# EAGLE schematic PhotoBooth_04 (EAGLE 6.3)
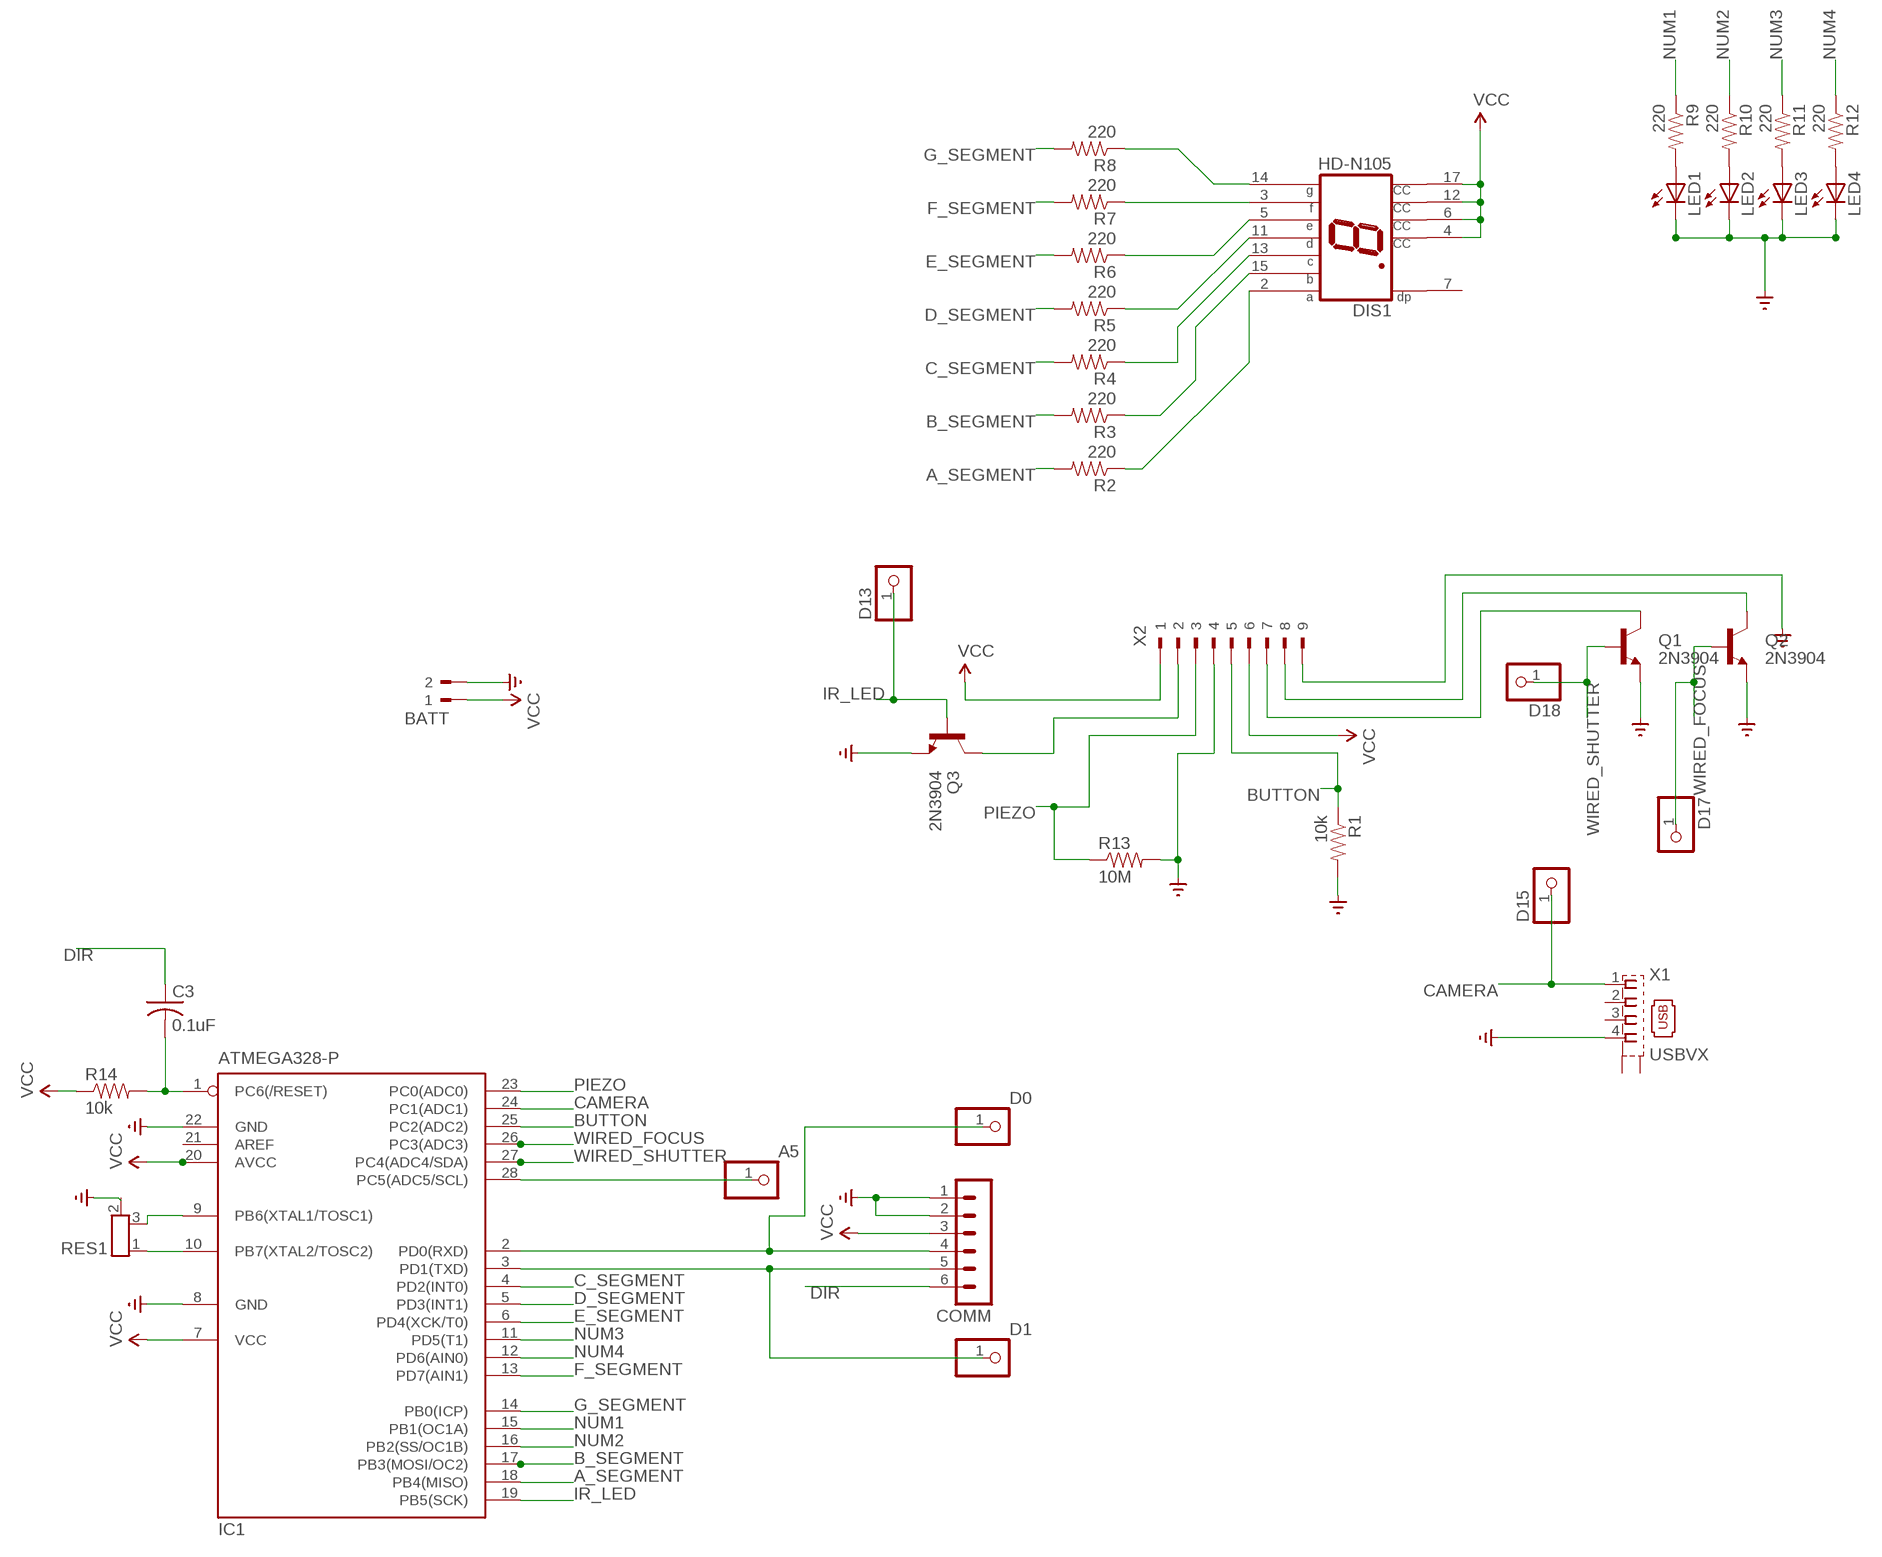
[diagram p0: schematic, sheet 1]

## Parts
A5  PINHD-1X1  [1X01]
BATT  180-2  [180-2]
C3  0.1uF  C-US025-024X044  [C025-024X044]
COMM  MA06-1  [MA06-1]
D0  PINHD-1X1  [1X01]
D1  PINHD-1X1  [1X01]
D13  PINHD-1X1  [1X01]
D15  PINHD-1X1  [1X01]
D17  PINHD-1X1  [1X01]
D18  PINHD-1X1  [1X01]
DIS1  HD-N105  [HDSP-Q]
IC1  ATMEGA328-P  MEGA8-P  [DIL28-3]
LED1  LED3MM  [LED3MM]
LED2  LED3MM  [LED3MM]
LED3  LED3MM  [LED3MM]
LED4  LED3MM  [LED3MM]
Q1  2N3904  TRANSISTOR_NPNTO-92-AMMO  [TO-92-AMMO]
Q2  2N3904  TRANSISTOR_NPNTO-92-AMMO  [TO-92-AMMO]
Q3  2N3904  TRANSISTOR_NPNTO-92-AMMO  [TO-92-AMMO]
R1  10k  RESISTORPTH-1/4W  [AXIAL-0.4]
R2  220  RESISTORPTH-1/4W  [AXIAL-0.4]
R3  220  RESISTORPTH-1/4W  [AXIAL-0.4]
R4  220  RESISTORPTH-1/4W  [AXIAL-0.4]
R5  220  RESISTORPTH-1/4W  [AXIAL-0.4]
R6  220  RESISTORPTH-1/4W  [AXIAL-0.4]
R7  220  RESISTORPTH-1/4W  [AXIAL-0.4]
R8  220  RESISTORPTH-1/4W  [AXIAL-0.4]
R9  220  RESISTORPTH-1/4W  [AXIAL-0.4]
R10  220  RESISTORPTH-1/4W  [AXIAL-0.4]
R11  220  RESISTORPTH-1/4W  [AXIAL-0.4]
R12  220  RESISTORPTH-1/4W  [AXIAL-0.4]
R13  10M  RESISTORPTH-1/4W  [AXIAL-0.4]
R14  10k  RESISTORPTH-1/4W  [AXIAL-0.4]
RES1  RESONZTT  [RESONZTT]
X1  USBVX  KUSBVX  [KUSBVX]
X2  180-9  [180-9]

## Nets
A_SEGMENT: IC1.18(PB4(MISO)) R2.P$2
B_SEGMENT: IC1.17(PB3(MOSI/OC2)) R3.P$2
BUTTON: IC1.25(PC2(ADC2)) R1.P$1 X2.5
C_SEGMENT: IC1.4(PD2(INT0)) R4.P$2
CAMERA: D15.1 IC1.24(PC1(ADC1)) X1.1
D_SEGMENT: IC1.5(PD3(INT1)) R5.P$2
DIR: C3.1 COMM.6
E_SEGMENT: IC1.6(PD4(XCK/T0)) R6.P$2
F_SEGMENT: IC1.13(PD7(AIN1)) R7.P$2
G_SEGMENT: IC1.14(PB0(ICP)) R8.P$2
GND: BATT.2 COMM.1 COMM.2 IC1.8(GND) IC1.22(GND) LED1.K(C) LED2.K(C) LED3.K(C) LED4.K(C) Q1.1(E) Q2.1(E) Q3.1(E) R1.P$2 R13.P$2 X1.4 X2.4 X2.9 ; supply symbol labelled GND_
IR_LED: D13.1 IC1.19(PB5(SCK)) Q3.2(B)
N$1: LED1.A R9.P$2
N$2: DIS1.14(G) R8.P$1
N$3: DIS1.3(F) R7.P$1
N$4: DIS1.5(E) R6.P$1
N$5: DIS1.11(D) R5.P$1
N$6: DIS1.13(C) R4.P$1
N$7: LED2.A R10.P$2
N$8: DIS1.15(B) R3.P$1
N$9: DIS1.2(A) R2.P$1
N$10: LED3.A R11.P$2
N$11: LED4.A R12.P$2
N$12: Q1.3(C) X2.7
N$13: IC1.10(PB7(XTAL2/TOSC2)) RES1.1(X1)
N$14: IC1.9(PB6(XTAL1/TOSC1)) RES1.3(X2)
N$15: C3.2 IC1.1(PC6(/RESET)) R14.P$2
N$16: A5.1 IC1.28(PC5(ADC5/SCL))
N$17: Q2.3(C) X2.8
N$18: Q3.3(C) X2.2
N$23: COMM.4 D0.1 IC1.2(PD0(RXD))
N$24: COMM.5 D1.1 IC1.3(PD1(TXD))
NUM1: IC1.15(PB1(OC1A)) R9.P$1
NUM2: IC1.16(PB2(SS/OC1B)) R10.P$1
NUM3: IC1.11(PD5(T1)) R11.P$1
NUM4: IC1.12(PD6(AIN0)) R12.P$1
PIEZO: IC1.23(PC0(ADC0)) R13.P$1 X2.3
VCC: BATT.1 COMM.3 DIS1.4(CC) DIS1.6(CC) DIS1.12(CC) DIS1.17(CC) IC1.7(VCC) IC1.20(AVCC) R14.P$1 X2.1 X2.6
WIRED_FOCUS: D17.1 IC1.26(PC3(ADC3)) Q2.2(B)
WIRED_SHUTTER: D18.1 IC1.27(PC4(ADC4/SDA)) Q1.2(B)
Unconnected: DIS1.7(DP) IC1.21(AREF) X1.2 X1.3 X1.M1(S1) X1.M2(S2)

## Power pins joined to a net without a drawn wire
GND: RES1.2(GND)

## Library data of the parts
A5 D0 D1 D13 D15 D17 D18 = pinhead-ez:PINHD-1X1: PIN HEADER
BATT = con-weidmueller-sl35:180-2: WEIDMUELLER CLAMP CONNECTOR; OC_FARNELL: unknown; OC_NEWARK: unknown
C3 = rcl:C-US: CAPACITOR, American symbol
COMM = con-lstb:MA06-1: PIN HEADER; OC_FARNELL: unknown; OC_NEWARK: unknown
DIS1 = display-hp:HD-N105: LED DISPLAY 1-character 7 segment, decimal point left; OC_FARNELL: unknown; OC_NEWARK: unknown
IC1 = atmel:MEGA8-P: MICROCONTROLLER 8 Kbytes FLASH, 1 kbytes SRAM, 512 bytes EEPROM, USART, 4-channel 10 bit ADC, 2-channel 8 bit ADC Pin compatible with Atmega48, ATMega88, ATMega168 Source: avr.lbr; OC_FARNELL: unknown; OC_NEWARK: unknown
LED1-LED4 = led:LED: LED OSRAM: - CHIPLED LG R971, LG N971, LY N971, LG Q971, LY Q971, LO R971, LY R971 LH N974, LH R974 LS Q976, LO Q976, LY Q976 LO Q996 - Hyper CHIPLED LW Q18S LB Q993, LB Q99A, LB R99A - SideLED LS A670, LO A670, LY A670, LG A670, LP A670 LB A673, LV A673, LT A673, LW A673 LH A674 LY A675 LS A676, LA A676, LO A676, LY A676, LW A676 LS A679, LY A679, LG A679 - Hyper Micro SIDELED® LS Y876, LA Y876, LO Y876, LY Y876 LT Y87S - SmartLED LW L88C, LW L88S LB L89C, LB L89S, LG L890 LS L89K, LO L89K, LY L89K LS L896, LA L896, LO L896, LY L896 - TOPLED LS T670, LO T670, LY T670, LG T670, LP T670 LSG T670, LSP T670, LSY T670, LOP T670, LYG T670 LG T671, LOG T671, LSG T671 LB T673, LV T673, LT T673, LW T673 LH T674 LS T676, LA T676, LO T676, LY T676, LB T676, LH T676, LSB T676, LW T676 LB T67C, LV T67C, LT T67C, LS T67K, LO T67K, LY T67K, LW E67C LS E67B, LA E67B, LO E67B, LY E67B, LB E67C, LV E67C, LT E67C LW T67C LS T679, LY T679, LG T679 LS T770, LO T770, LY T770, LG T770, LP T770 LB T773, LV T773, LT T773, LW T773 LH T774 LS E675, LA E675, LY E675, LS T675 LS T776, LA T776, LO T776, LY T776, LB T776 LHGB T686 LT T68C, LB T68C - Hyper Mini TOPLED® LB M676 - Mini TOPLED Santana® LG M470 LS M47K, LO M47K, LY M47K Source: http://www.osram.convergy.de LUXEON: - LUMILED® LXK2-PW12-R00, LXK2-PW12-S00, LXK2-PW14-U00, LXK2-PW14-V00 LXK2-PM12-R00, LXK2-PM12-S00, LXK2-PM14-U00 LXK2-PE12-Q00, LXK2-PE12-R00, LXK2-PE12-S00, LXK2-PE14-T00, LXK2-PE14-U00 LXK2-PB12-K00, LXK2-PB12-L00, LXK2-PB12-M00, LXK2-PB14-N00, LXK2-PB14-P00, LXK2-PB14-Q00 LXK2-PR12-L00, LXK2-PR12-M00, LXK2-PR14-Q00, LXK2-PR14-R00 LXK2-PD12-Q00, LXK2-PD12-R00, LXK2-PD12-S00 LXK2-PH12-R00, LXK2-PH12-S00 LXK2-PL12-P00, LXK2-PL12-Q00, LXK2-PL12-R00 Source: www.luxeon.com KINGBRIGHT: KA-3528ASYC Source: www.kingbright.com
Q1-Q3 = SparkFun:TRANSISTOR_NPN: Transistor NPN BJT configuration in SOT23 package. MMBT2222 is the common NPN we use. Double check BCE configuration again layout.
R1-R14 = SparkFun:RESISTOR: Resistor Basic schematic elements and footprints for 0603, 1206, and PTH resistors.
RES1 = ADS:RESONZTT
X1 = con-kycon:KUSBVX: Vertical,Top Entry Universal Serial Bus Connector KUSBVX Series Source: KYCON Sibalco USB vertical socket KUSBV.pdf
X2 = con-weidmueller-sl35:180-9: WEIDMUELLER CLAMP CONNECTOR; OC_FARNELL: unknown; OC_NEWARK: unknown

## Net classes
0 default: width 0.381 mm